# Altium schematic sheet ATmega328p.SchDoc: ATmega328p and Seeeduino
size A4; DocumentNumber: 1; Revision: 1; SheetNumber: 1; SheetTotal: 11
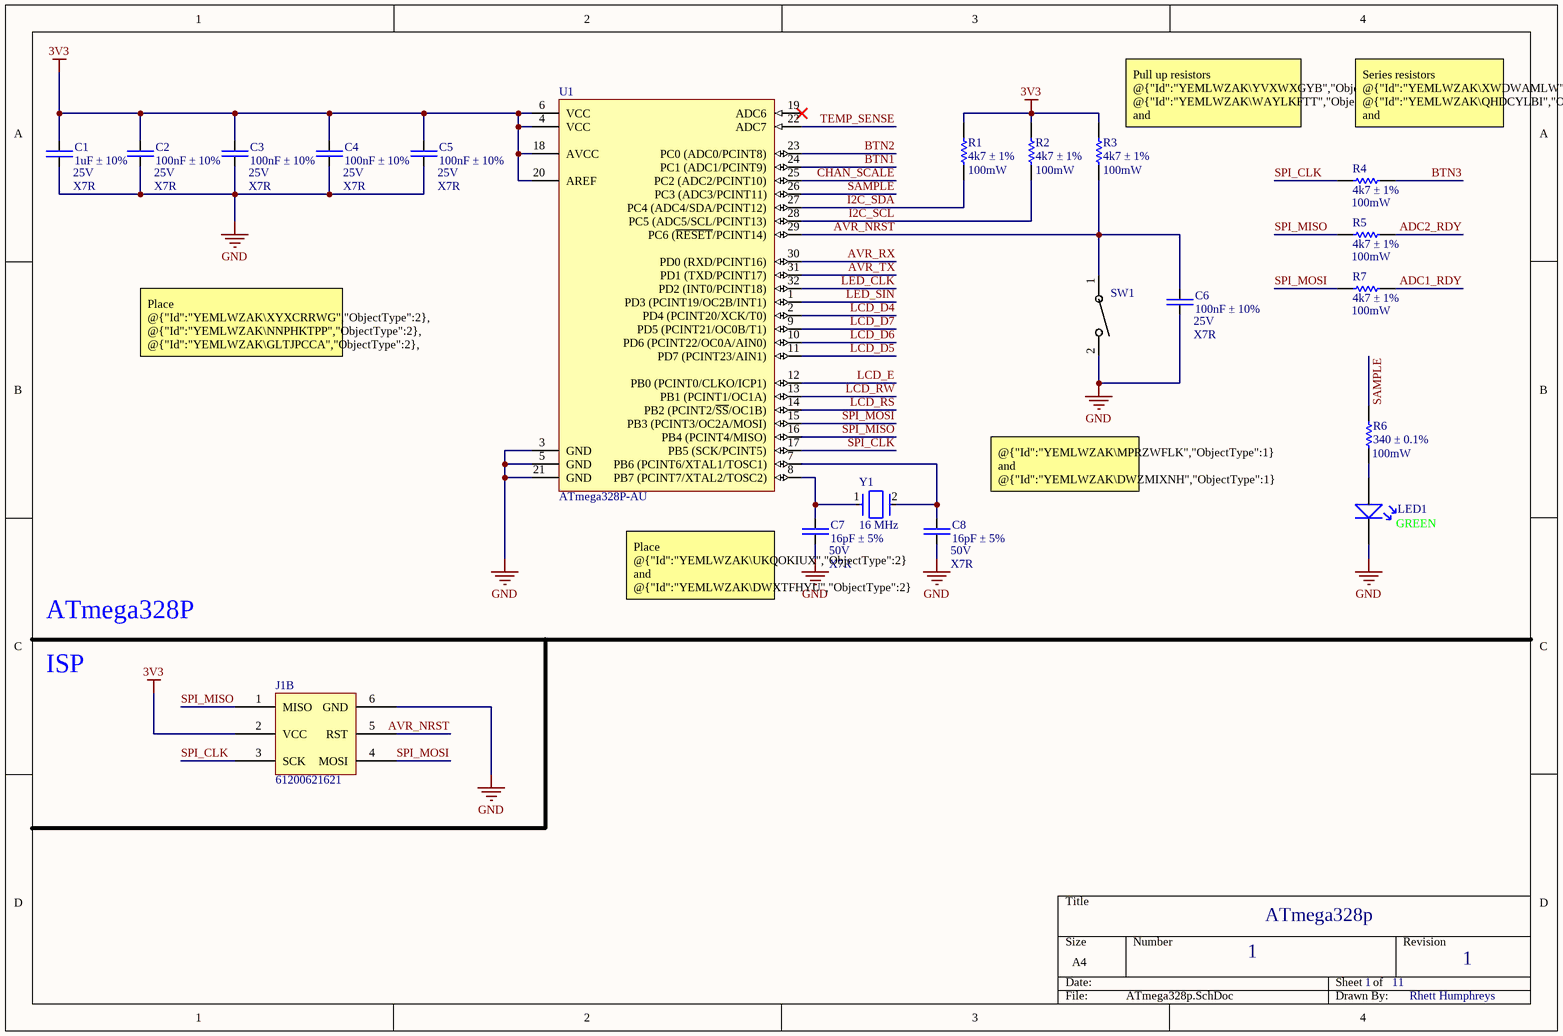
[diagram p0: ATmega328p.SchDoc]

## Parts
C1  1uF ± 10%  [CAP-0805]
C2  100nF ± 10%  [CAP-0603]
C3  100nF ± 10%  [CAP-0603]
C4  100nF ± 10%  [CAP-0603]
C5  100nF ± 10%  [CAP-0603]
C6  100nF ± 10%  [CAP-0603]
C7  16pF ± 5%  [CAP-0603]
C8  16pF ± 5%  [CAP-0603]
J1  61200621621  [61200621621]  (part B of 2)
LED1  (no value)  [0603 LED]
R1  4k7 ± 1%  [RES-0603]
R2  4k7 ± 1%  [RES-0603]
R3  4k7 ± 1%  [RES-0603]
R4  4k7 ± 1%  [RES-0603]
R5  4k7 ± 1%  [RES-0603]
R6  340 ± 0.1%  [RES-0603]
R7  4k7 ± 1%  [RES-0603]
SW1  PTS636SK43JSMTRLFS  [SW_PTS636S-J_CNK]  (value not drawn)
U1  ATmega328P-AU  [32A_M]
Y1  16 MHz  [FP-ABM7-MFG]

## Nets
3V3: C1.2 C2.2 C3.2 C4.2 C5.2 J1.2(VCC) R1.1 R2.1 R3.1 U1.4(VCC) U1.6(VCC) U1.18(AVCC) U1.20(AREF)
GND: C1.1 C2.1 C3.1 C4.1 C5.1 C6.1 C7.1 C8.1 J1.6(GND) LED1.2 SW1.2 U1.3(GND) U1.5(GND) U1.21(GND)
ADC1_RDY: R7.2
ADC2_RDY: R5.2
AVR_NRST: C6.2 J1.5(RST) R3.2 SW1.1 U1.29(PC6_(~{RESET}/PCINT14))
AVR_RX: U1.30(PD0_(RXD/PCINT16))
AVR_TX: U1.31(PD1_(TXD/PCINT17))
BTN1: U1.24(PC1_(ADC1/PCINT9))
BTN2: U1.23(PC0_(ADC0/PCINT8))
BTN3: R4.2
CHAN_SCALE: U1.25(PC2_(ADC2/PCINT10))
I2C_SCL: R2.2 U1.28(PC5_(ADC5/SCL/PCINT13))
I2C_SDA: R1.2 U1.27(PC4_(ADC4/SDA/PCINT12))
LCD_D4: U1.2(PD4_(PCINT20/XCK/T0))
LCD_D5: U1.11(PD7_(PCINT23/AIN1))
LCD_D6: U1.10(PD6_(PCINT22/OC0A/AIN0))
LCD_D7: U1.9(PD5_(PCINT21/OC0B/T1))
LCD_E: U1.12(PB0_(PCINT0/CLKO/ICP1))
LCD_RS: U1.14(PB2_(PCINT2/~{SS}/OC1B))
LCD_RW: U1.13(PB1_(PCINT1/OC1A))
LED_CLK: U1.32(PD2_(INT0/PCINT18))
LED_SIN: U1.1(PD3_(PCINT19/OC2B/INT1))
SAMPLE: R6.1 U1.26(PC3_(ADC3/PCINT11))
SPI_CLK: J1.3(SCK) R4.1 U1.17(PB5_(SCK/PCINT5))
SPI_MISO: J1.1(MISO) R5.1 U1.16(PB4_(PCINT4/MISO))
SPI_MOSI: J1.4(MOSI) R7.1 U1.15(PB3_(PCINT3/OC2A/MOSI))
TEMP_SENSE: U1.22(ADC7)
NetC7_2: C7.2 U1.8(PB7_(PCINT7/XTAL2/TOSC2)) Y1.1
NetC8_2: C8.2 U1.7(PB6_(PCINT6/XTAL1/TOSC1)) Y1.2
NetLED1_1: LED1.1 R6.2

Not connected (* = marked no-connect by the designer): U1 19(ADC6)*

## Notes on the sheet
- (near C1) 25V
- (near C2) 25V
- (near C3) 25V
- (near C4) 25V
- (near C5) 25V
- (near R1) 100mW
- (near R2) 100mW
- (near R3) 100mW
- (near R3) Pull up resistors @{"Id":"YEMLWZAK\YVXWXGYB","ObjectType":2}, @{"Id":"YEMLWZAK\WAYLKFTT","ObjectType":2} and @{"Id":"YEMLWZAK\NGWYUVVG","ObjectType":2} for I2C bus signals @{"Id":"JIGDRHWK\IIGRDYOB","ObjectType":1}, @{"Id":"JIGDRHWK\FTFHPBWY","ObjectType":1} and @{"Id":"YEMLWZAK\QSTGJNDM","ObjectType":1}
- Series resistors @{"Id":"YEMLWZAK\XWDWAMLW","ObjectType":2}, @{"Id":"YEMLWZAK\QHDCYLBI","ObjectType":2} and @{"Id":"YEMLWZAK\KNMCQFHG","ObjectType":2} to protect lines connected to SPI programming lines
- (near C1) X7R
- (near C2) X7R
- (near C3) X7R
- (near C4) X7R
- (near C5) X7R
- 100mW
- (near R7) 100mW
- Place @{"Id":"YEMLWZAK\XYXCRRWG","ObjectType":2}, @{"Id":"YEMLWZAK\NNPHKTPP","ObjectType":2}, @{"Id":"YEMLWZAK\GLTJPCCA","ObjectType":2}, @{"Id":"YEMLWZAK\HCRQOYSD","ObjectType":2} as close as possible to VCC, AVCC and AREF pins of @{"Id":"YEMLWZAK\HIGJTEGZ","ObjectType":2} as possible. Place @{"Id":"YEMLWZAK\RMDZLOSG","ObjectType":2} relatively close to @{"Id":"YEMLWZAK\HIGJTEGZ","ObjectType":2}
- (near C6) X7R
- (near C6) 25V
- @{"Id":"YEMLWZAK\MPRZWFLK","ObjectType":1} and @{"Id":"YEMLWZAK\DWZMIXNH","ObjectType":1} have been swapped to assist with routing
- (near R6) 100mW
- (near C7) X7R
- (near C7) 50V
- (near C8) X7R
- (near C8) 50V
- (near LED1) GREEN
- ATmega328P
- Place @{"Id":"YEMLWZAK\UKQOKIUX","ObjectType":2} and @{"Id":"YEMLWZAK\DWXTFHYU","ObjectType":2} as close to @{"Id":"YEMLWZAK\STRTPVYI","ObjectType":2} as possible. Place @{"Id":"YEMLWZAK\STRTPVYI","ObjectType":2} as close to @{"Id":"YEMLWZAK\HIGJTEGZ","ObjectType":2} as possible
- ISP
- ATmega328p
- 1
- 11
- Rhett Humphreys

## Library data of the parts
C1 = CAP-0805: Capacitor chip unpolarized. 0603
C2-C8 = CAP-0603: Capacitor chip unpolarized. 0603
LED1 = 0603 LED
R1-R7 = RES-0603: Resistor chip. 0603
SW1 = PTS636SK43JSMTRLFS: No Description Available; Mfr_Name: C&K Components; Type: Tactile Switches
U1 = CMP-0095-00269-2: 8-bit AVR Microcontroller, 32KB Flash, 1KB EEPROM, 2KB SRAM, 32-pin TQFP, Industrial Grade (-40°C to 85°C); PackageDescription: 32-Lead, 7x7x1.0 mm Body, 0.8mm Lead Pitch, Thin Profile Plastic Quad Flat Package (TQFP); DatasheetVersion: revD, May-2011; RevisionNote: DatasheetVersion & PackageVersion updated. URLs added.; ComponentLink1URL: http://www.atmel.com/; ComponentLink2Description: ATmega48A/48PA/88A/88PA/168A/168PA/328/328P Datasheet; Code_JEDEC: MS-026-ABA; ComponentLink1Description: Manufacturer URL; PackageReference: 32A; ComponentLink3Description: ATmega48A/48PA/88A/88PA/168A/168PA/328/328P Summary; ComponentLink2URL: http://www.atmel.com/dyn/resources/prod_documents/doc8271.pdf; PackageVersion: revC, Oct-2010; ComponentLink3URL: http://www.atmel.com/dyn/resources/prod_documents/8271S.pdf
Y1 = CMP-27762-000095-1: Crystal 16MHz ±20ppm 18pF SMD-2 6mm x 3.5mm; ESR (Equivalent Series Resistance): 50R; Frequency Stability: 30ppm; Width: 3.3mm; Frequency: 16MHz; Radiation Hardening: No; Height: 0.055inch; Tolerance: 20ppm; Length: 6mm; Case/Package: CSMD; Lead Free: Lead Free; Min Operating Temperature: -40°C; Termination: SMD/SMT; Operating Frequency: 16 MHz; Resistor Type: Ceramic; Packaging: Tape and Reel; Mount: Surface Mount; Load Capacitance: 18pF; Frequency Tolerance: 20ppm; Depth: 3.5mm; Series: ABM7; Package Quantity: 1000; Max Operating Temperature: 85°C; Number of Pins: 2